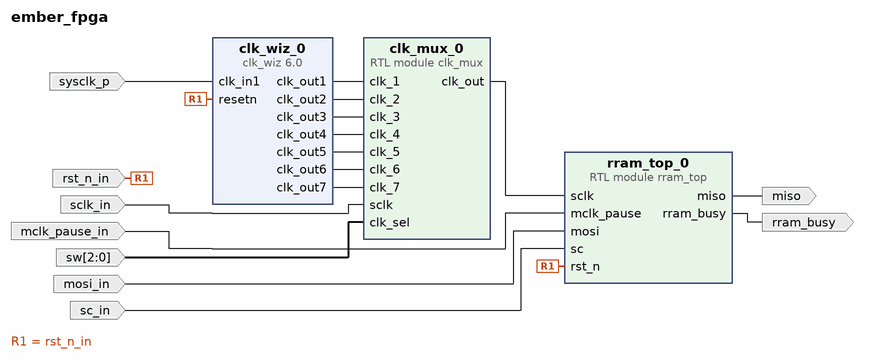
[diagram p0: block diagram of the top level]
# Vivado block design ember_fpga, xc7k325tffg900-2, Vivado 2020.2
create_bd_design ember_fpga

create_bd_port -dir O rram_busy
create_bd_port -dir O miso
create_bd_port -dir I -type rst rst_n_in
create_bd_port -dir I sclk_in
create_bd_port -dir I sc_in
create_bd_port -dir I mosi_in
create_bd_port -dir I mclk_pause_in
create_bd_port -dir I -type clk sysclk_p
set_property -dict {CONFIG.FREQ_HZ 120000000} [get_bd_ports sysclk_p]
create_bd_port -dir I -from 2 -to 0 sw

create_bd_cell -type ip -vlnv xilinx.com:ip:clk_wiz:6.0 clk_wiz_0
set_property -dict [list \
  CONFIG.CLKOUT1_JITTER 112.035 \
  CONFIG.CLKOUT1_PHASE_ERROR 87.180 \
  CONFIG.CLKOUT1_REQUESTED_OUT_FREQ 120.000 \
  CONFIG.CLKOUT2_JITTER 115.831 \
  CONFIG.CLKOUT2_PHASE_ERROR 87.180 \
  CONFIG.CLKOUT2_REQUESTED_OUT_FREQ 100.000 \
  CONFIG.CLKOUT2_USED true \
  CONFIG.CLKOUT3_JITTER 120.663 \
  CONFIG.CLKOUT3_PHASE_ERROR 87.180 \
  CONFIG.CLKOUT3_REQUESTED_OUT_FREQ 80 \
  CONFIG.CLKOUT3_USED true \
  CONFIG.CLKOUT4_JITTER 125.094 \
  CONFIG.CLKOUT4_PHASE_ERROR 87.180 \
  CONFIG.CLKOUT4_REQUESTED_OUT_FREQ 66.66667 \
  CONFIG.CLKOUT4_USED true \
  CONFIG.CLKOUT5_JITTER 132.683 \
  CONFIG.CLKOUT5_PHASE_ERROR 87.180 \
  CONFIG.CLKOUT5_REQUESTED_OUT_FREQ 50 \
  CONFIG.CLKOUT5_USED true \
  CONFIG.CLKOUT6_JITTER 154.057 \
  CONFIG.CLKOUT6_PHASE_ERROR 87.180 \
  CONFIG.CLKOUT6_REQUESTED_OUT_FREQ 25 \
  CONFIG.CLKOUT6_USED true \
  CONFIG.CLKOUT7_JITTER 188.586 \
  CONFIG.CLKOUT7_PHASE_ERROR 87.180 \
  CONFIG.CLKOUT7_REQUESTED_OUT_FREQ 10 \
  CONFIG.CLKOUT7_USED true \
  CONFIG.MMCM_CLKFBOUT_MULT_F 12.000 \
  CONFIG.MMCM_CLKOUT0_DIVIDE_F 10.000 \
  CONFIG.MMCM_CLKOUT1_DIVIDE 12 \
  CONFIG.MMCM_CLKOUT2_DIVIDE 15 \
  CONFIG.MMCM_CLKOUT3_DIVIDE 18 \
  CONFIG.MMCM_CLKOUT4_DIVIDE 24 \
  CONFIG.MMCM_CLKOUT5_DIVIDE 48 \
  CONFIG.MMCM_CLKOUT6_DIVIDE 120 \
  CONFIG.NUM_OUT_CLKS 7 \
  CONFIG.RESET_PORT resetn \
  CONFIG.RESET_TYPE ACTIVE_LOW \
] [get_bd_cells clk_wiz_0]
create_bd_cell -type module -reference clk_mux clk_mux_0
create_bd_cell -type module -reference rram_top rram_top_0

# ---- connections ----

connect_bd_net [get_bd_pins clk_mux_0/clk_out] [get_bd_pins rram_top_0/sclk]
connect_bd_net [get_bd_pins clk_wiz_0/clk_out1] [get_bd_pins clk_mux_0/clk_1]
connect_bd_net [get_bd_pins clk_wiz_0/clk_out2] [get_bd_pins clk_mux_0/clk_2]
connect_bd_net [get_bd_pins clk_wiz_0/clk_out3] [get_bd_pins clk_mux_0/clk_3]
connect_bd_net [get_bd_pins clk_wiz_0/clk_out4] [get_bd_pins clk_mux_0/clk_4]
connect_bd_net [get_bd_pins clk_wiz_0/clk_out5] [get_bd_pins clk_mux_0/clk_5]
connect_bd_net [get_bd_pins clk_wiz_0/clk_out6] [get_bd_pins clk_mux_0/clk_6]
connect_bd_net [get_bd_pins clk_wiz_0/clk_out7] [get_bd_pins clk_mux_0/clk_7]
connect_bd_net -net mclk_pause_0_1 [get_bd_ports mclk_pause_in] [get_bd_pins rram_top_0/mclk_pause]
connect_bd_net -net mosi_0_1 [get_bd_ports mosi_in] [get_bd_pins rram_top_0/mosi]
connect_bd_net [get_bd_pins rram_top_0/miso] [get_bd_ports miso]
connect_bd_net [get_bd_pins rram_top_0/rram_busy] [get_bd_ports rram_busy]
connect_bd_net -net rst_n_0_1 [get_bd_ports rst_n_in] [get_bd_pins clk_wiz_0/resetn] [get_bd_pins rram_top_0/rst_n]
connect_bd_net -net sc_0_1 [get_bd_ports sc_in] [get_bd_pins rram_top_0/sc]
connect_bd_net [get_bd_ports sclk_in] [get_bd_pins clk_mux_0/sclk]
connect_bd_net [get_bd_ports sw] [get_bd_pins clk_mux_0/clk_sel]
connect_bd_net [get_bd_ports sysclk_p] [get_bd_pins clk_wiz_0/clk_in1]

validate_bd_design
save_bd_design
